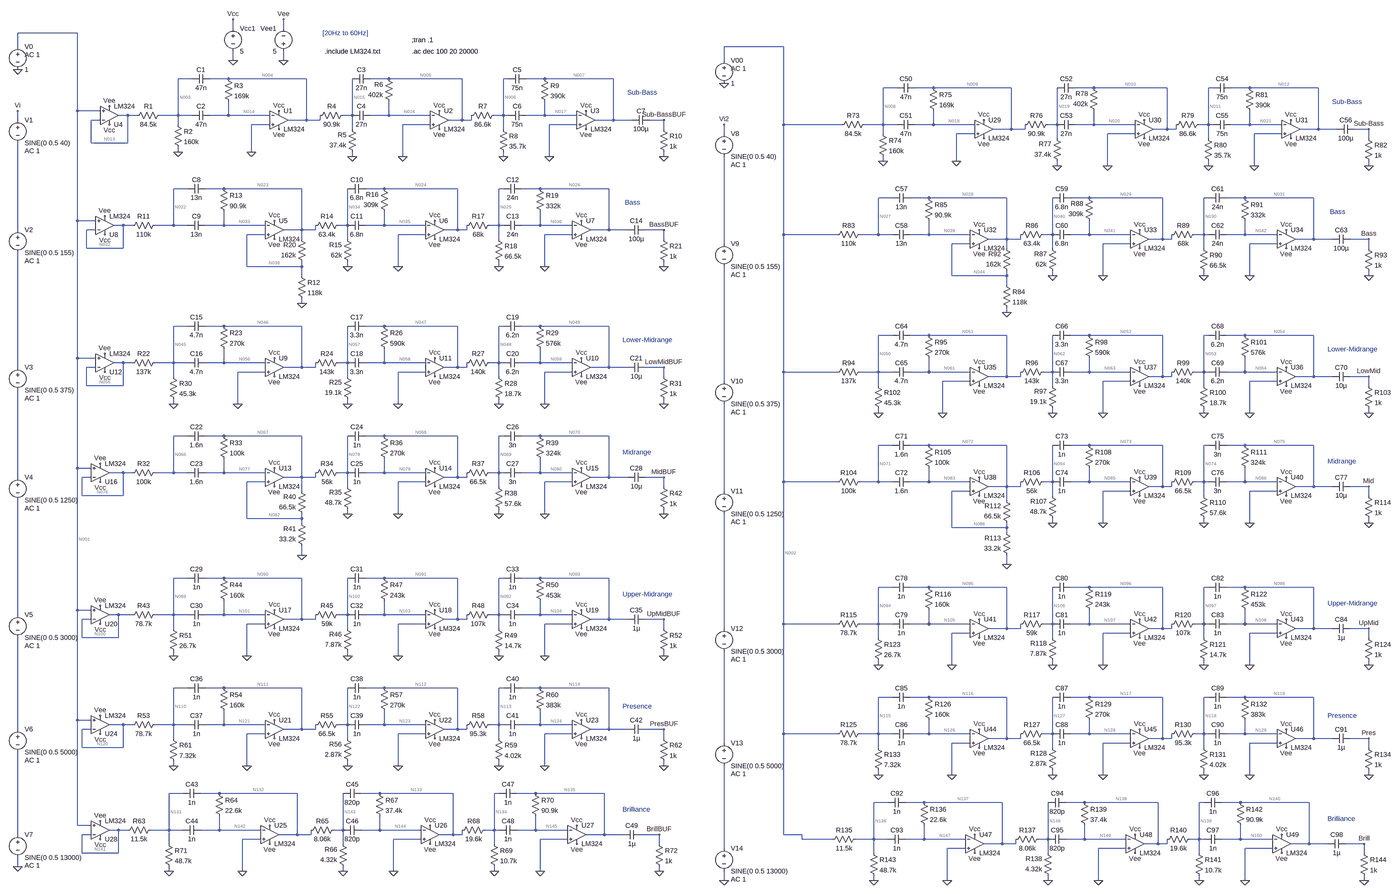
[diagram p0: schematic AllFiltersBuf_NonBuf.asc, whole sheet]
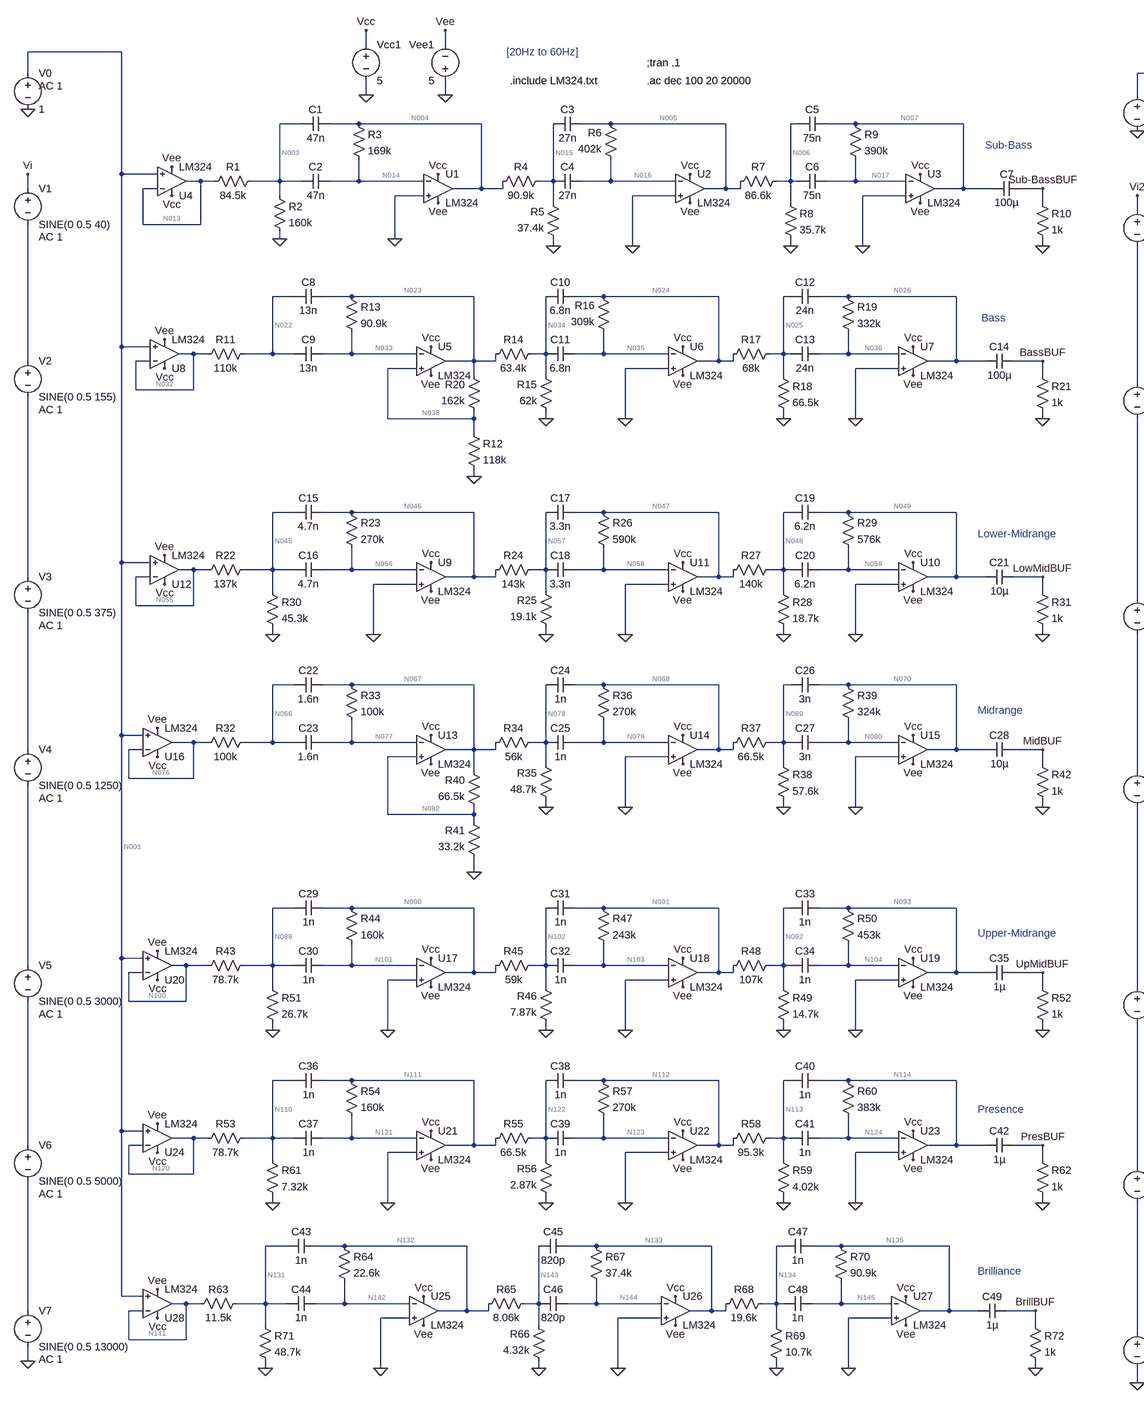
[diagram p1: schematic AllFiltersBuf_NonBuf.asc, part, row 1 of 1, column 1 of 2]
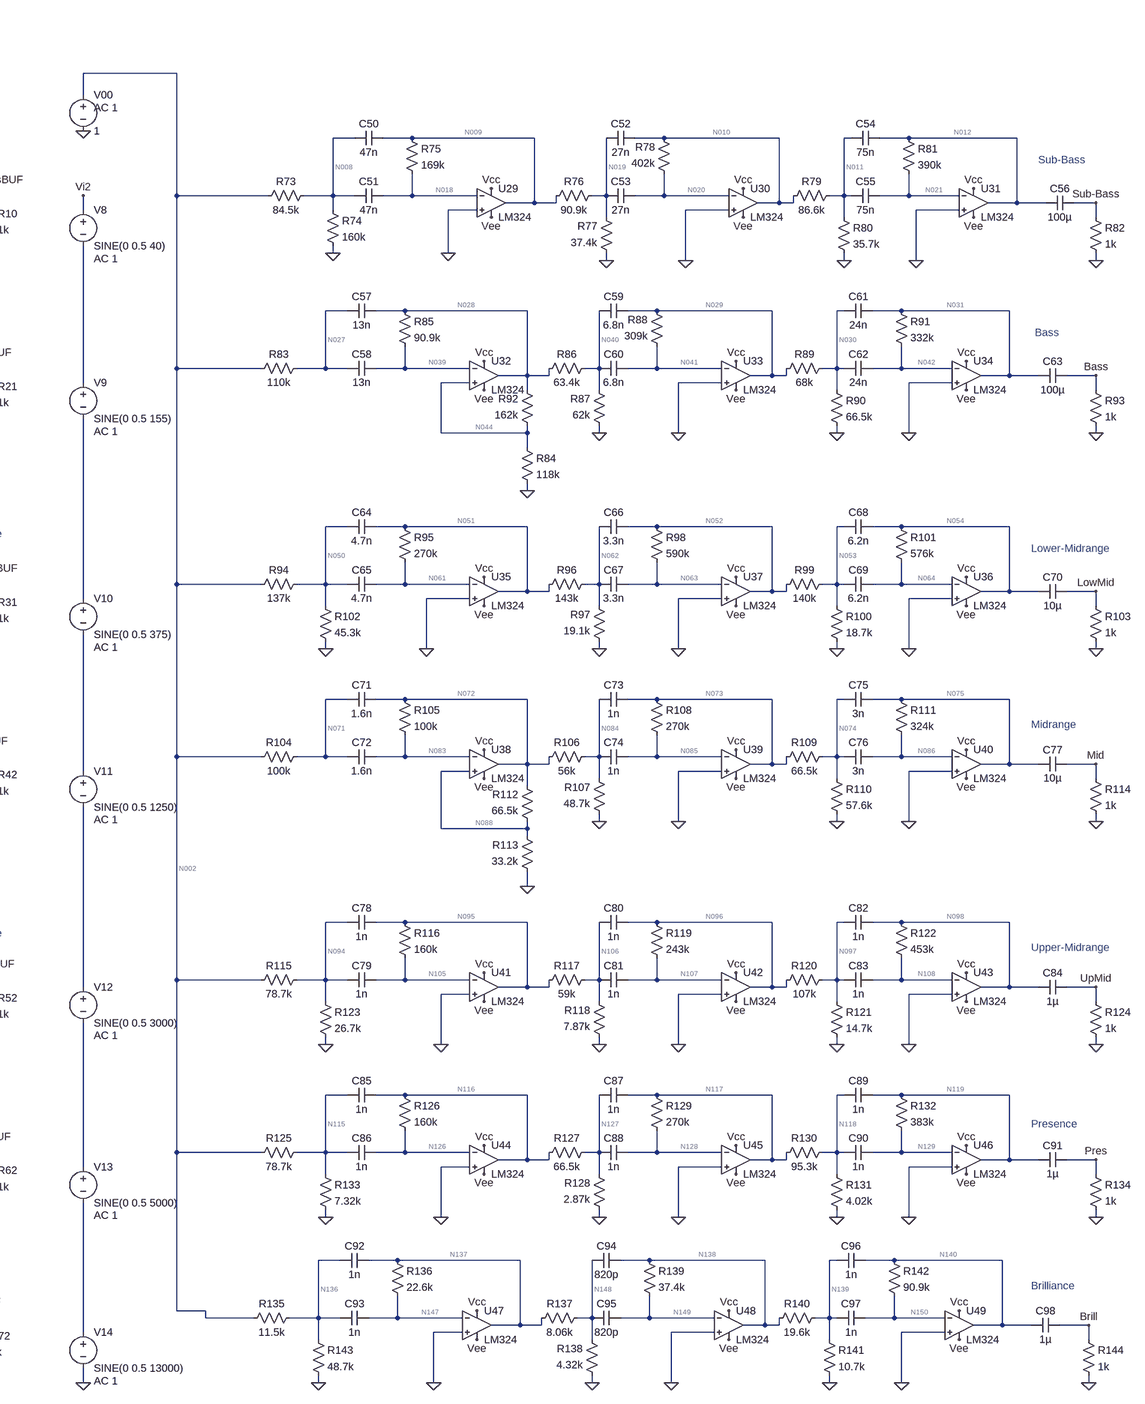
[diagram p2: schematic AllFiltersBuf_NonBuf.asc, part, row 1 of 1, column 2 of 2]
* AllFiltersBuf_NonBuf.asc
R1 N003 N013 84.5k
V1 Vi N037 SINE(0 0.5 40) AC 1
R2 N003 0 160k
R3 N004 N014 169k
R4 N015 N004 90.9k
R5 0 N015 37.4k
R6 N016 N005 402k
R7 N005 N006 86.6k
R8 N006 0 35.7k
R9 N007 N017 390k
C1 N004 N003 47n
C2 N014 N003 47n
C3 N005 N015 27n
C4 N016 N015 27n
C5 N007 N006 75n
C6 N017 N006 75n
XU1 0 N014 Vcc Vee N004 LM324  ; pins In+ In- V+ V- OUT
XU2 0 N016 Vcc Vee N005 LM324  ; pins In+ In- V+ V- OUT
XU3 0 N017 Vcc Vee N007 LM324  ; pins In+ In- V+ V- OUT
Vcc1 Vcc 0 5
Vee1 0 Vee 5
C7 Sub-BassBUF N007 100µ
R10 Sub-BassBUF 0 1k
XU4 N001 N013 Vcc Vee N013 LM324  ; pins In+ In- V+ V- OUT
R11 N022 N032 110k
V2 N037 N060 SINE(0 0.5 155) AC 1
R12 N038 0 118k
R13 N023 N033 90.9k
R14 N034 N023 63.4k
R15 0 N034 62k
R16 N035 N024 309k
R17 N024 N025 68k
R18 N025 0 66.5k
R19 N026 N036 332k
C8 N023 N022 13n
C9 N033 N022 13n
C10 N024 N034 6.8n
C11 N035 N034 6.8n
C12 N026 N025 24n
C13 N036 N025 24n
R20 N038 N023 162k
XU5 N038 N033 Vcc Vee N023 LM324  ; pins In+ In- V+ V- OUT
XU6 0 N035 Vcc Vee N024 LM324  ; pins In+ In- V+ V- OUT
XU7 0 N036 Vcc Vee N026 LM324  ; pins In+ In- V+ V- OUT
C14 BassBUF N026 100µ
R21 BassBUF 0 1k
XU8 N001 N032 Vcc Vee N032 LM324  ; pins In+ In- V+ V- OUT
R22 N045 N055 137k
V3 N060 N081 SINE(0 0.5 375) AC 1
R23 N046 N056 270k
R24 N057 N046 143k
R25 0 N057 19.1k
R26 N047 N058 590k
R27 N047 N048 140k
R28 N048 0 18.7k
R29 N049 N059 576k
C15 N046 N045 4.7n
C16 N056 N045 4.7n
C17 N047 N057 3.3n
C18 N058 N057 3.3n
C19 N049 N048 6.2n
C20 N059 N048 6.2n
R30 N045 0 45.3k
XU9 0 N056 Vcc Vee N046 LM324  ; pins In+ In- V+ V- OUT
XU10 0 N059 Vcc Vee N049 LM324  ; pins In+ In- V+ V- OUT
XU11 0 N058 Vcc Vee N047 LM324  ; pins In+ In- V+ V- OUT
C21 LowMidBUF N049 10µ
R31 LowMidBUF 0 1k
XU12 N001 N055 Vcc Vee N055 LM324  ; pins In+ In- V+ V- OUT
R32 N066 N076 100k
V4 N081 N099 SINE(0 0.5 1250) AC 1
R33 N067 N077 100k
R34 N078 N067 56k
R35 0 N078 48.7k
R36 N068 N079 270k
R37 N068 N069 66.5k
R38 N069 0 57.6k
R39 N070 N080 324k
C22 N067 N066 1.6n
C23 N077 N066 1.6n
C24 N068 N078 1n
C25 N079 N078 1n
C26 N070 N069 3n
C27 N080 N069 3n
R40 N082 N067 66.5k
R41 0 N082 33.2k
XU13 N082 N077 Vcc Vee N067 LM324  ; pins In+ In- V+ V- OUT
XU14 0 N079 Vcc Vee N068 LM324  ; pins In+ In- V+ V- OUT
XU15 0 N080 Vcc Vee N070 LM324  ; pins In+ In- V+ V- OUT
C28 MidBUF N070 10µ
R42 MidBUF 0 1k
XU16 N001 N076 Vcc Vee N076 LM324  ; pins In+ In- V+ V- OUT
R43 N089 N100 78.7k
V5 N099 N125 SINE(0 0.5 3000) AC 1
R44 N090 N101 160k
R45 N102 N090 59k
R46 0 N102 7.87k
R47 N091 N103 243k
R48 N091 N092 107k
R49 N092 0 14.7k
R50 N093 N104 453k
C29 N090 N089 1n
C30 N101 N089 1n
C31 N091 N102 1n
C32 N103 N102 1n
C33 N093 N092 1n
C34 N104 N092 1n
R51 N089 0 26.7k
XU17 0 N101 Vcc Vee N090 LM324  ; pins In+ In- V+ V- OUT
XU18 0 N103 Vcc Vee N091 LM324  ; pins In+ In- V+ V- OUT
XU19 0 N104 Vcc Vee N093 LM324  ; pins In+ In- V+ V- OUT
C35 UpMidBUF N093 1µ
R52 UpMidBUF 0 1k
XU20 N001 N100 Vcc Vee N100 LM324  ; pins In+ In- V+ V- OUT
R53 N110 N120 78.7k
V6 N125 N146 SINE(0 0.5 5000) AC 1
R54 N111 N121 160k
R55 N122 N111 66.5k
R56 0 N122 2.87k
R57 N112 N123 270k
R58 N112 N113 95.3k
R59 N113 0 4.02k
R60 N114 N124 383k
C36 N111 N110 1n
C37 N121 N110 1n
C38 N112 N122 1n
C39 N123 N122 1n
C40 N114 N113 1n
C41 N124 N113 1n
R61 N110 0 7.32k
XU21 0 N121 Vcc Vee N111 LM324  ; pins In+ In- V+ V- OUT
XU22 0 N123 Vcc Vee N112 LM324  ; pins In+ In- V+ V- OUT
XU23 0 N124 Vcc Vee N114 LM324  ; pins In+ In- V+ V- OUT
C42 PresBUF N114 1µ
R62 PresBUF 0 1k
XU24 N001 N120 Vcc Vee N120 LM324  ; pins In+ In- V+ V- OUT
R63 N131 N141 11.5k
V7 N146 0 SINE(0 0.5 13000) AC 1
R64 N132 N142 22.6k
R65 N143 N132 8.06k
R66 0 N143 4.32k
R67 N133 N144 37.4k
R68 N133 N134 19.6k
R69 N134 0 10.7k
R70 N135 N145 90.9k
C43 N132 N131 1n
C44 N142 N131 1n
C45 N133 N143 820p
C46 N144 N143 820p
C47 N135 N134 1n
C48 N145 N134 1n
R71 N131 0 48.7k
XU25 0 N142 Vcc Vee N132 LM324  ; pins In+ In- V+ V- OUT
XU26 0 N144 Vcc Vee N133 LM324  ; pins In+ In- V+ V- OUT
XU27 0 N145 Vcc Vee N135 LM324  ; pins In+ In- V+ V- OUT
C49 BrillBUF N135 1µ
R72 BrillBUF 0 1k
XU28 N001 N141 Vcc Vee N141 LM324  ; pins In+ In- V+ V- OUT
V0 N001 0 1 AC 1
R73 N008 N002 84.5k
R74 N008 0 160k
R75 N009 N018 169k
R76 N019 N009 90.9k
R77 0 N019 37.4k
R78 N020 N010 402k
R79 N010 N011 86.6k
R80 N011 0 35.7k
R81 N012 N021 390k
C50 N009 N008 47n
C51 N018 N008 47n
C52 N010 N019 27n
C53 N020 N019 27n
C54 N012 N011 75n
C55 N021 N011 75n
XU29 0 N018 Vcc Vee N009 LM324  ; pins In+ In- V+ V- OUT
XU30 0 N020 Vcc Vee N010 LM324  ; pins In+ In- V+ V- OUT
XU31 0 N021 Vcc Vee N012 LM324  ; pins In+ In- V+ V- OUT
C56 Sub-Bass N012 100µ
R82 Sub-Bass 0 1k
R83 N027 N002 110k
R84 N044 0 118k
R85 N028 N039 90.9k
R86 N040 N028 63.4k
R87 0 N040 62k
R88 N041 N029 309k
R89 N029 N030 68k
R90 N030 0 66.5k
R91 N031 N042 332k
C57 N028 N027 13n
C58 N039 N027 13n
C59 N029 N040 6.8n
C60 N041 N040 6.8n
C61 N031 N030 24n
C62 N042 N030 24n
R92 N044 N028 162k
XU32 N044 N039 Vcc Vee N028 LM324  ; pins In+ In- V+ V- OUT
XU33 0 N041 Vcc Vee N029 LM324  ; pins In+ In- V+ V- OUT
XU34 0 N042 Vcc Vee N031 LM324  ; pins In+ In- V+ V- OUT
C63 Bass N031 100µ
R93 Bass 0 1k
R94 N050 N002 137k
R95 N051 N061 270k
R96 N062 N051 143k
R97 0 N062 19.1k
R98 N052 N063 590k
R99 N052 N053 140k
R100 N053 0 18.7k
R101 N054 N064 576k
C64 N051 N050 4.7n
C65 N061 N050 4.7n
C66 N052 N062 3.3n
C67 N063 N062 3.3n
C68 N054 N053 6.2n
C69 N064 N053 6.2n
R102 N050 0 45.3k
XU35 0 N061 Vcc Vee N051 LM324  ; pins In+ In- V+ V- OUT
XU36 0 N064 Vcc Vee N054 LM324  ; pins In+ In- V+ V- OUT
XU37 0 N063 Vcc Vee N052 LM324  ; pins In+ In- V+ V- OUT
C70 LowMid N054 10µ
R103 LowMid 0 1k
R104 N071 N002 100k
R105 N072 N083 100k
R106 N084 N072 56k
R107 0 N084 48.7k
R108 N073 N085 270k
R109 N073 N074 66.5k
R110 N074 0 57.6k
R111 N075 N086 324k
C71 N072 N071 1.6n
C72 N083 N071 1.6n
C73 N073 N084 1n
C74 N085 N084 1n
C75 N075 N074 3n
C76 N086 N074 3n
R112 N088 N072 66.5k
R113 0 N088 33.2k
XU38 N088 N083 Vcc Vee N072 LM324  ; pins In+ In- V+ V- OUT
XU39 0 N085 Vcc Vee N073 LM324  ; pins In+ In- V+ V- OUT
XU40 0 N086 Vcc Vee N075 LM324  ; pins In+ In- V+ V- OUT
C77 Mid N075 10µ
R114 Mid 0 1k
R115 N094 N002 78.7k
R116 N095 N105 160k
R117 N106 N095 59k
R118 0 N106 7.87k
R119 N096 N107 243k
R120 N096 N097 107k
R121 N097 0 14.7k
R122 N098 N108 453k
C78 N095 N094 1n
C79 N105 N094 1n
C80 N096 N106 1n
C81 N107 N106 1n
C82 N098 N097 1n
C83 N108 N097 1n
R123 N094 0 26.7k
XU41 0 N105 Vcc Vee N095 LM324  ; pins In+ In- V+ V- OUT
XU42 0 N107 Vcc Vee N096 LM324  ; pins In+ In- V+ V- OUT
XU43 0 N108 Vcc Vee N098 LM324  ; pins In+ In- V+ V- OUT
C84 UpMid N098 1µ
R124 UpMid 0 1k
R125 N115 N002 78.7k
R126 N116 N126 160k
R127 N127 N116 66.5k
R128 0 N127 2.87k
R129 N117 N128 270k
R130 N117 N118 95.3k
R131 N118 0 4.02k
R132 N119 N129 383k
C85 N116 N115 1n
C86 N126 N115 1n
C87 N117 N127 1n
C88 N128 N127 1n
C89 N119 N118 1n
C90 N129 N118 1n
R133 N115 0 7.32k
XU44 0 N126 Vcc Vee N116 LM324  ; pins In+ In- V+ V- OUT
XU45 0 N128 Vcc Vee N117 LM324  ; pins In+ In- V+ V- OUT
XU46 0 N129 Vcc Vee N119 LM324  ; pins In+ In- V+ V- OUT
C91 Pres N119 1µ
R134 Pres 0 1k
R135 N136 N002 11.5k
R136 N137 N147 22.6k
R137 N148 N137 8.06k
R138 0 N148 4.32k
R139 N138 N149 37.4k
R140 N138 N139 19.6k
R141 N139 0 10.7k
R142 N140 N150 90.9k
C92 N137 N136 1n
C93 N147 N136 1n
C94 N138 N148 820p
C95 N149 N148 820p
C96 N140 N139 1n
C97 N150 N139 1n
R143 N136 0 48.7k
XU47 0 N147 Vcc Vee N137 LM324  ; pins In+ In- V+ V- OUT
XU48 0 N149 Vcc Vee N138 LM324  ; pins In+ In- V+ V- OUT
XU49 0 N150 Vcc Vee N140 LM324  ; pins In+ In- V+ V- OUT
C98 Brill N140 1µ
R144 Brill 0 1k
V8 Vi2 N043 SINE(0 0.5 40) AC 1
V9 N043 N065 SINE(0 0.5 155) AC 1
V10 N065 N087 SINE(0 0.5 375) AC 1
V11 N087 N109 SINE(0 0.5 1250) AC 1
V12 N109 N130 SINE(0 0.5 3000) AC 1
V13 N130 N151 SINE(0 0.5 5000) AC 1
V14 N151 0 SINE(0 0.5 13000) AC 1
V00 N002 0 1 AC 1
;tran .1
.ac dec 100 20 20000
* [20Hz to 60Hz]
.include LM324.txt
* Sub-Bass
* Bass
* Lower-Midrange
* Midrange
* Upper-Midrange
* Presence
* Brilliance
* Sub-Bass
* Bass
* Lower-Midrange
* Midrange
* Upper-Midrange
* Presence
* Brilliance
.backanno
.end

* Results of the author's LTspice run, read from the files saved beside the schematic
* Operating Point, zero values left out:
*   V(n003) = 654.3 mV
*   V(n013) = 999.9 mV
*   V(n004) = -3.404 mV
*   V(n014) = -33.62 µV
*   V(n015) = -992.3 µV
*   V(n016) = -33.57 µV
*   V(n005) = -8.051 mV
*   V(n006) = -2.35 mV
*   V(n007) = -7.812 mV
*   V(n017) = -33.58 µV
*   V(vee) = -5 V
*   V(vcc) = 5 V
*   V(n001) = 1 V
*   V(n022) = 999.9 mV
*   V(n032) = 999.9 mV
*   V(n038) = 1.006 mV
*   V(n023) = -840.3 µV
*   V(n033) = 972.6 µV
*   V(n034) = -415.5 µV
*   V(n035) = -33.59 µV
*   V(n024) = -6.196 mV
*   V(n025) = -3.064 mV
*   V(n026) = -6.655 mV
*   V(n036) = -33.59 µV
*   V(n045) = 248.5 mV
*   V(n055) = 999.9 mV
*   V(n046) = -5.419 mV
*   V(n056) = -33.6 µV
*   V(n057) = -638.5 µV
*   V(n047) = -11.8 mV
*   V(n058) = -33.54 µV
*   V(n048) = -1.391 mV
*   V(n049) = -11.52 mV
*   V(n059) = -33.54 µV
*   V(n066) = 999.9 mV
*   V(n076) = 999.9 mV
*   V(n067) = -2.379 mV
*   V(n077) = -384.5 µV
*   V(n078) = -1.107 mV
*   V(n068) = -5.419 mV
*   V(n079) = -33.6 µV
*   V(n069) = -2.515 mV
*   V(n070) = -6.496 mV
*   V(n080) = -33.59 µV
*   V(n082) = -350.9 µV
*   V(n089) = 253.3 mV
*   V(n100) = 999.9 mV
*   V(n090) = -3.225 mV
*   V(n101) = -33.62 µV
*   V(n102) = -379.5 µV
*   V(n091) = -4.88 mV
*   V(n103) = -33.61 µV
*   V(n092) = -589.5 µV
*   V(n093) = -9.068 mV
*   V(n104) = -33.56 µV
*   V(n110) = 85.09 mV
*   V(n120) = 999.9 mV
*   V(n111) = -3.225 mV
*   V(n121) = -33.62 µV
*   V(n122) = -133.4 µV
*   V(n112) = -5.419 mV
*   V(n123) = -33.6 µV
*   V(n113) = -219.3 µV
*   V(n114) = -7.672 mV
*   V(n124) = -33.58 µV
*   V(n131) = 808.9 mV
*   V(n141) = 999.9 mV
*   V(n132) = -484.4 µV
*   V(n142) = -33.65 µV
*   V(n143) = -169 µV
*   V(n133) = -779.6 µV
*   V(n144) = -33.65 µV
*   V(n134) = -275.3 µV
*   V(n135) = -1.847 mV
*   V(n145) = -33.64 µV
*   V(n008) = 654.4 mV
*   V(n002) = 1 V
*   V(n009) = -3.404 mV
*   V(n018) = -33.62 µV
*   V(n019) = -992.3 µV
*   V(n020) = -33.57 µV
*   V(n010) = -8.051 mV
*   V(n011) = -2.35 mV
*   V(n012) = -7.812 mV
*   V(n021) = -33.58 µV
*   V(n027) = 1 V
*   V(n044) = 1.006 mV
*   V(n028) = -840.3 µV
*   V(n039) = 972.6 µV
*   V(n040) = -415.5 µV
*   V(n041) = -33.59 µV
*   V(n029) = -6.196 mV
*   V(n030) = -3.064 mV
*   V(n031) = -6.655 mV
*   V(n042) = -33.59 µV
*   V(n050) = 248.5 mV
*   V(n051) = -5.419 mV
*   V(n061) = -33.6 µV
*   V(n062) = -638.5 µV
*   V(n052) = -11.8 mV
*   V(n063) = -33.54 µV
*   V(n053) = -1.391 mV
*   V(n054) = -11.52 mV
*   V(n064) = -33.54 µV
*   V(n071) = 1 V
*   V(n072) = -2.379 mV
*   V(n083) = -384.5 µV
*   V(n084) = -1.107 mV
*   V(n073) = -5.419 mV
*   V(n085) = -33.6 µV
*   V(n074) = -2.515 mV
*   V(n075) = -6.496 mV
*   V(n086) = -33.59 µV
*   V(n088) = -350.9 µV
*   V(n094) = 253.3 mV
*   V(n095) = -3.225 mV
*   V(n105) = -33.62 µV
*   V(n106) = -379.5 µV
*   V(n096) = -4.88 mV
*   V(n107) = -33.61 µV
*   V(n097) = -589.5 µV
*   V(n098) = -9.068 mV
*   V(n108) = -33.56 µV
*   V(n115) = 85.1 mV
*   V(n116) = -3.225 mV
*   V(n126) = -33.62 µV
*   V(n127) = -133.4 µV
*   V(n117) = -5.419 mV
*   V(n128) = -33.6 µV
*   V(n118) = -219.3 µV
*   V(n119) = -7.672 mV
*   V(n129) = -33.58 µV
*   V(n136) = 809 mV
*   V(n137) = -484.4 µV
*   V(n147) = -33.65 µV
*   V(n148) = -169 µV
*   V(n138) = -779.6 µV
*   V(n149) = -33.65 µV
*   V(n139) = -275.3 µV
*   V(n140) = -1.847 mV
*   V(n150) = -33.64 µV
*   I(R143) = 16.61 µA
*   I(R142) = -19.94 nA
*   I(R141) = -25.73 nA
*   I(R140) = -25.73 nA
*   I(R139) = -19.94 nA
*   I(R138) = 39.13 nA
*   I(R137) = 39.13 nA
*   I(R136) = -19.94 nA
*   I(R135) = -16.61 µA
*   I(R133) = 11.63 µA
*   I(R132) = -19.94 nA
*   I(R131) = -54.56 nA
*   I(R130) = -54.56 nA
*   I(R129) = -19.94 nA
*   I(R128) = 46.49 nA
*   I(R127) = 46.49 nA
*   I(R126) = -19.94 nA
*   I(R125) = -11.63 µA
*   I(R123) = 9.488 µA
*   I(R122) = -19.94 nA
*   I(R121) = -40.1 nA
*   I(R120) = -40.1 nA
*   I(R119) = -19.94 nA
*   I(R118) = 48.22 nA
*   I(R117) = 48.22 nA
*   I(R116) = -19.94 nA
*   I(R115) = -9.488 µA
*   I(R113) = 10.57 nA
*   I(R112) = 30.5 nA
*   I(R111) = -19.94 nA
*   I(R110) = -43.66 nA
*   I(R109) = -43.66 nA
*   I(R108) = -19.94 nA
*   I(R107) = 22.72 nA
*   I(R106) = 22.72 nA
*   I(R105) = -19.94 nA
*   I(R102) = 5.485 µA
*   I(R101) = -19.94 nA
*   I(R100) = -74.36 nA
*   I(R99) = -74.36 nA
*   I(R98) = -19.94 nA
*   I(R97) = 33.43 nA
*   I(R96) = 33.43 nA
*   I(R95) = -19.94 nA
*   I(R94) = -5.485 µA
*   I(R92) = 11.4 nA
*   I(R91) = -19.94 nA
*   I(R90) = -46.07 nA
*   I(R89) = -46.07 nA
*   I(R88) = 19.94 nA
*   I(R87) = 6.701 nA
*   I(R86) = 6.701 nA
*   I(R85) = -19.94 nA
*   I(R84) = 8.528 nA
*   I(R81) = -19.94 nA
*   I(R80) = -65.83 nA
*   I(R79) = -65.83 nA
*   I(R78) = 19.94 nA
*   I(R77) = 26.53 nA
*   I(R76) = 26.53 nA
*   I(R75) = -19.94 nA
*   I(R74) = 4.09 µA
*   I(R73) = -4.09 µA
*   I(R71) = 16.61 µA
*   I(R70) = -19.94 nA
*   I(R69) = -25.73 nA
*   I(R68) = -25.73 nA
*   I(R67) = -19.94 nA
*   I(R66) = 39.13 nA
*   I(R65) = 39.13 nA
*   I(R64) = -19.94 nA
*   I(R63) = -16.61 µA
*   I(R61) = 11.62 µA
*   I(R60) = -19.94 nA
*   I(R59) = -54.56 nA
*   I(R58) = -54.56 nA
*   I(R57) = -19.94 nA
*   I(R56) = 46.49 nA
*   I(R55) = 46.49 nA
*   I(R54) = -19.94 nA
*   I(R53) = -11.62 µA
*   I(R51) = 9.487 µA
*   I(R50) = -19.94 nA
*   I(R49) = -40.1 nA
*   I(R48) = -40.1 nA
*   I(R47) = -19.94 nA
*   I(R46) = 48.22 nA
*   I(R45) = 48.22 nA
*   I(R44) = -19.94 nA
*   I(R43) = -9.487 µA
*   I(R41) = 10.57 nA
*   I(R40) = 30.5 nA
*   I(R39) = -19.94 nA
*   I(R38) = -43.66 nA
*   I(R37) = -43.66 nA
*   I(R36) = -19.94 nA
*   I(R35) = 22.72 nA
*   I(R34) = 22.72 nA
*   I(R33) = -19.94 nA
*   I(R30) = 5.485 µA
*   I(R29) = -19.94 nA
*   I(R28) = -74.36 nA
*   I(R27) = -74.36 nA
*   I(R26) = -19.94 nA
*   I(R25) = 33.43 nA
*   I(R24) = 33.43 nA
*   I(R23) = -19.94 nA
*   I(R22) = -5.485 µA
*   I(R20) = 11.4 nA
*   I(R19) = -19.94 nA
*   I(R18) = -46.07 nA
*   I(R17) = -46.07 nA
*   I(R16) = 19.94 nA
*   I(R15) = 6.701 nA
*   I(R14) = 6.701 nA
*   I(R13) = -19.94 nA
*   I(R12) = 8.528 nA
*   I(R9) = -19.94 nA
*   I(R8) = -65.83 nA
*   I(R7) = -65.83 nA
*   I(R6) = 19.94 nA
*   I(R5) = 26.53 nA
*   I(R4) = 26.53 nA
*   I(R3) = -19.94 nA
*   I(R2) = 4.09 µA
*   I(R1) = -4.09 µA
*   I(V00) = -47.3 µA
*   I(V0) = 138.7 nA
*   I(Vee1) = -16.65 mA
*   I(Vcc1) = -16.66 mA